# EasyEDA Pro project b6s.eprj, board PCB1
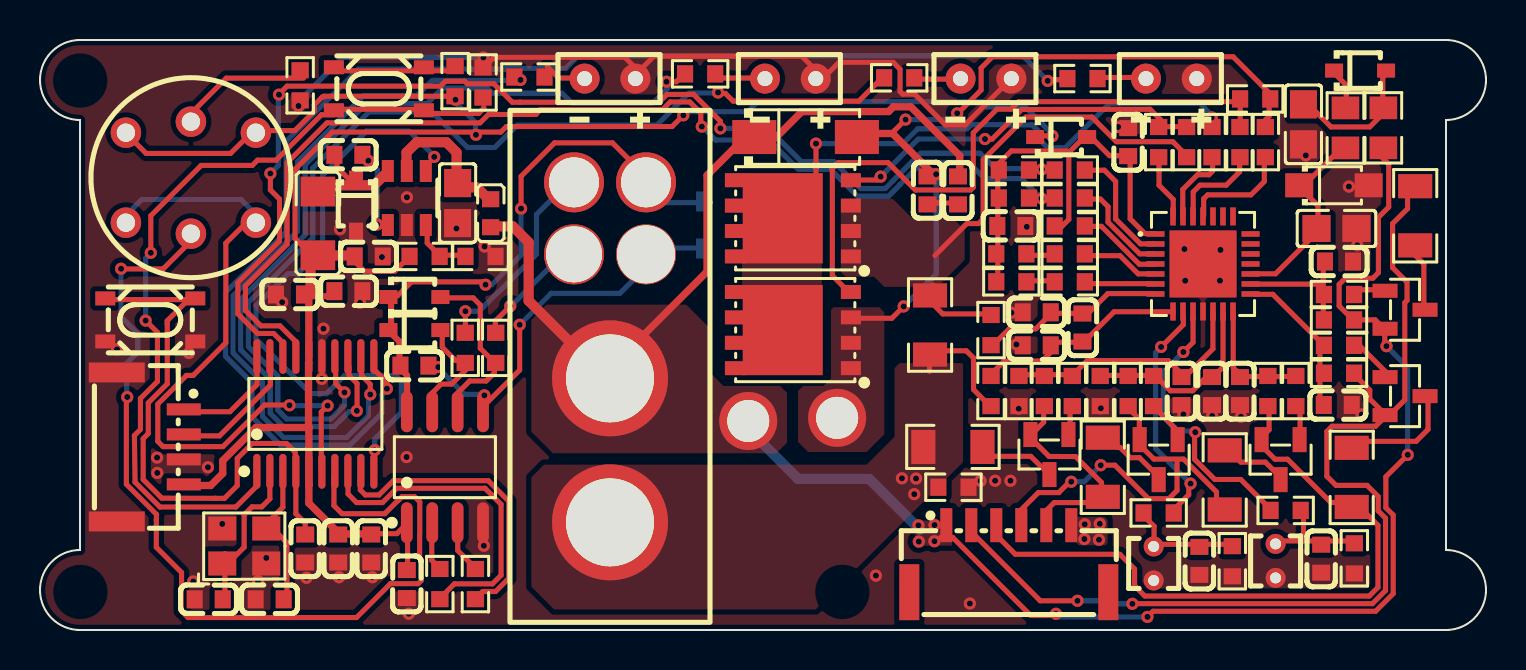
[diagram p1: board, top side]
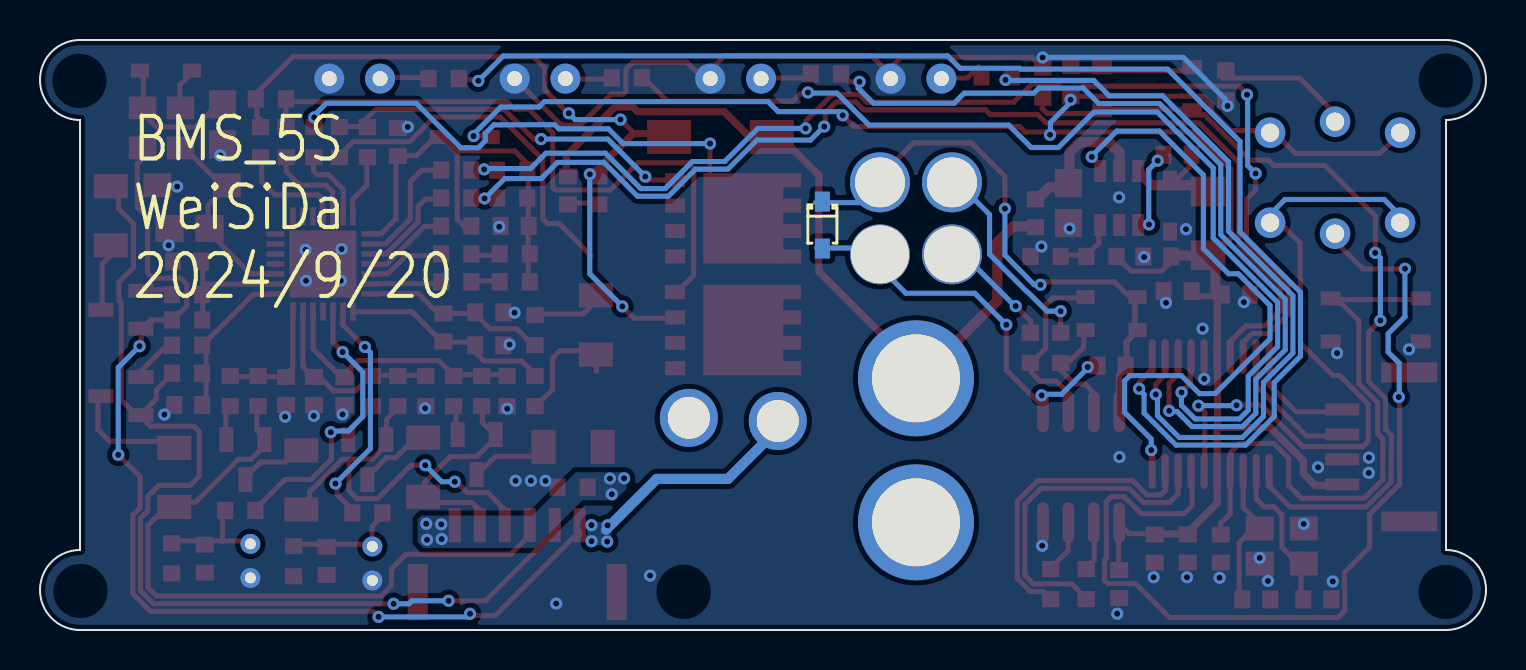
[diagram p2: board, bottom side, seen from below]

Outline 72.3 x 29.5 mm; copper layers: Top Layer, Bottom Layer. Coordinates in mm from the lower left corner of the outline.
Outline path: 2,25.5 arc(0,27.5) 2,29.5 70.3,29.5 arc(72.3,27.5) 70.3,25.5 70.3,4 arc(72.3,2) 70.3,0 2,0 arc(0,2) 2,4 2,25.5
Stack: Top Layer 0.035mm / Dielectric1 1.51mm FR4 er 4.5 / Bottom Layer 0.035mm

## Design rules (mm)
template: 自定义配置
spacing copperThickness1oz (default): track to track 0.127, other pairs 0.152 to 0.3
spacing copperThickness2oz: track to track 0.203, other pairs 0.152 to 0.3
track width copperThickness1oz (default): min 0.127, default 0.254, max 2.54
track width copperThickness2oz: min 0.203, default 0.254, max 2.54
differential pair differentialPair (default): width min 0.127, default 0.254, max 2.54; gap min 0.152, default 0.152
via viaSize (default): diameter min 0.5, default 0.61, max 10; hole min 0.3, default 0.305, max 6.299

## Placement (name value [footprint] x y rotation side)
C1  100nF  [C0603]  48.57 20.2 0 top
C2  10uF  [C0603]  54.41 24.39 90 top
C3  100nF  [C0603]  64.06 3.57 90 top
C4  100nF  [C0603]  57.97 3.45 90 top
C5  100nF  [C0603]  52.12 15.12 90 top
C6  100nF  [C0603]  49.84 15.89 0 top
C7  100nF  [C0603]  49.84 14.23 0 top
C8  100nF  [C0603]  58.6 11.95 90 top
C9  100nF  [C0603]  60 11.95 90 top
C10  100nF  [C0603]  64.89 11.25 180 top
C11  100nF  [C0603]  64.95 18.42 180 top
C13  100nF  [C0603]  57.08 11.95 90 top
C14  2.2uF  [C0805]  63.17 25.28 90 top
C17  100nF  [C0603]  15.42 16.94 180 top
C19  4.7uF  [C0603]  12.5 16.77 0 top
C24  10nF  [C0603]  14.91 4.07 90 top
C25  1uF  [C0603]  16.56 4.07 90 top
C26  100nF  [C0603]  13.26 4.07 90 top
C27  20pF  [C0603]  8.43 1.53 0 top
C28  20pF  [C0603]  11.48 1.53 0 top
C29  4.7uF  [C0805]  20.88 21.35 270 top
C30  100nF  [C0603]  15.42 23.76 0 top
C31  10uF  [C0603]  16.44 18.68 0 top
C32  100nF  [C0603]  18.34 2.3 270 top
C33  2.2uF  [C0805]  64.82 20.08 180 top
C34  100nF  [C0603]  45.9 21.98 90 top
C35  100nF  [C0603]  44.38 21.98 270 top
C36  2.2uF  [C0603]  18.72 13.22 180 top
CN10  WAFER-GH1.25-4PLB  [CONN-SMD_4P-P1.25_XUNPU_WAFER-GH1.25-4PLB]  5.51 9.15 270 top
D1  1N5819WS S4  [SOD-323_L1.6-W1.3-LS2.7-RD]  66 27.97 0 top
D2  SS14  [SMA_L4.2-W2.6-LS5.3-RD]  38.28 24.65 0 top
D3  1N5819WS S4  [SOD-323_L1.6-W1.3-LS2.7-RD]  51.06 24.65 0 top
D4  1N5819WS S4  [SOD-323_L1.6-W1.3-LS2.7-RD]  15.8 21.22 270 top
D6  1N5819WS S4  [SOD-323_L1.6-W1.3-LS2.7-RD]  18.72 16.65 0 top
D7  1N5819WS S4  [SOD-323_L1.6-W1.3-LS2.7-RD]  18.72 15 0 top
D50  SMF24A  [SOD-123FL_L2.7-W1.8-LS3.8-RD]  64.7 22.23 0 top
D51  SD03  [SOD-323_L1.8-W1.3-LS2.5-RD]  33.18 20.25 270 bottom
H9  VOUT  [AMSS_XT60_2+4]  28.5 12.58 180 top
KEY1  -  [LED_BUTTON]  7.55 22.62 180 top
L1  10uH  [L1206]  13.9 20.33 90 top
LED1  XL-257UBC-L  [LED-TH_L5.0-W2.5-P2.54-FD_GREEN_XL-257SYGD-L]  47.3 27.57 180 top
LED2  XL-257UBC-L  [LED-TH_L5.0-W2.5-P2.54-FD_GREEN_XL-257SYGD-L]  37.52 27.57 180 top
LED3  XL-257UBC-L  [LED-TH_L5.0-W2.5-P2.54-FD_GREEN_XL-257SYGD-L]  28.5 27.57 180 top
LED4  XL-257UBC-L  [LED-TH_L5.0-W2.5-P2.54-FD_GREEN_XL-257SYGD-L]  56.57 27.57 180 top
P1  -  [Wire_14AWG]  39.86 10.61 0 top
P2  -  [Wire_14AWG]  35.41 10.45 0 top
Q6  SS8550  [SOT-23-3_L2.9-W1.3-P1.90-LS2.4-BR]  62.03 8.52 90 top
Q7  SS8550  [SOT-23-3_L2.9-W1.3-P1.90-LS2.4-BR]  55.93 8.52 90 top
Q8  SS8550  [SOT-23-3_L2.9-W1.3-P1.90-LS2.4-BR]  50.47 8.77 90 top
Q9  SS8550  [SOT-23-3_L2.9-W1.3-P1.90-LS2.4-BR]  68.25 11.69 180 top
Q10  SS8550  [SOT-23-3_L2.9-W1.3-P1.90-LS2.4-BR]  68.25 16.01 180 top
Q11  NCEP3090GU  [DFN-8_L5.8-W4.9-P1.27-LS6.1-BL-2]  37.64 15 90 top
Q12  NCEP3090GU  [DFN-8_L5.8-W4.9-P1.27-LS6.1-BL-2]  37.64 20.58 90 top
R1  NC  [R0603]  48.95 11.95 90 top
R2  10kΩ  [R0603]  51.49 20.2 180 top
R3  10kΩ  [R0603]  48.69 21.6 180 top
R4  10kΩ  [R0603]  48.69 23 180 top
R5  100Ω  [R0603]  51.49 23 0 top
R6  100Ω  [R0603]  51.49 21.6 0 top
R8  100Ω  [R0603]  51.49 18.81 0 top
R9  100Ω  [R0603]  51.49 17.41 0 top
R10  10kΩ  [R0603]  48.57 18.81 180 top
R11  10kΩ  [R0603]  48.57 17.41 180 top
R12  100Ω  [R0603]  55.93 5.85 0 top
R13  100Ω  [R0603]  62.28 5.98 180 top
R14  MF52A103F3950 (A1)  [RES-TH_L2.5-W2.5-P1.70-D0.3]  55.68 3.33 90 top
R15  NC  [R0603]  65.72 3.58 90 top
R16  MF52A103F3950 (A1)  [RES-TH_L2.5-W2.5-P1.70-D0.3]  61.78 3.45 90 top
R17  NC  [R0603]  59.62 3.44 90 top
R18  5mΩ  [R1206]  44.5 15.25 270 top
R20  100Ω  [R0603]  47.55 11.95 90 top
R21  100Ω  [R0603]  47.55 15 270 top
R22  1kΩ  [R0603]  58.6 24.39 270 top
R23  1kΩ  [R0603]  60 24.39 270 top
R24  1kΩ  [R0603]  55.93 24.39 270 top
R25  10MΩ  [R0603]  57.33 24.39 90 top
R26  1MΩ  [R0603]  60.76 26.55 180 top
R27  1MΩ  [R0603]  61.27 24.39 270 top
R28  NC  [R0603]  53.01 11.95 90 top
R31  1kΩ  [R0603]  64.95 15.5 0 top
R32  510Ω  [R0603]  64.95 16.77 0 top
R33  1kΩ  [R0603]  64.95 12.84 0 top
R34  510Ω  [R0603]  64.95 14.23 0 top
R35  1kΩ  [R0603]  61.39 11.95 270 top
R36  510Ω  [R0603]  62.79 11.95 270 top
R37  1kΩ  [R0603]  54.41 11.95 270 top
R38  510Ω  [R0603]  55.68 11.95 270 top
R39  1kΩ  [R0603]  50.22 11.95 270 top
R40  510Ω  [R0603]  51.61 11.95 270 top
R54  10kΩ  [R0603]  22.15 27.37 270 top
R55  1kΩ  [R0603]  20.75 27.44 90 top
R56  33kΩ  [R0603]  19.23 18.68 180 top
R57  10kΩ  [R0603]  22.02 18.68 180 top
R58  1kΩ  [R0603]  33.01 27.81 180 top
R60  1kΩ  [R0603]  42.96 27.61 180 top
R61  1kΩ  [R0603]  52.12 27.57 180 top
R62  1kΩ  [R0603]  24.47 27.65 180 top
R64  150Ω  [R1206]  68.76 20.71 90 top
R65  150Ω  [R1206]  65.58 7.63 270 top
R66  150Ω  [R1206]  59.23 7.5 270 top
R67  150Ω  [R1206]  53.14 8.14 270 top
R68  150Ω  [R1206]  45.65 9.15 180 top
R69  0Ω  [R0603]  45.67 7.14 0 top
R70  1kΩ  [R0603]  13.01 27.23 270 top
R71  100Ω  [R0603]  19.99 2.3 270 top
R72  100Ω  [R0603]  21.77 2.3 270 top
R73  100Ω  [R0603]  22.79 14.11 90 top
R74  100Ω  [R0603]  21.26 14.11 90 top
R75  51Ω  [R0805]  67.17 25.11 270 top
R76  51Ω  [R0805]  65.27 25.1 90 top
SW13  HX TS3425BA 250gf  [SW-SMD_4P-L4.2-W3.2-P2.15-LS4.6-1]  5.51 15.5 0 top
SW14  HX TS3425BA 250gf  [SW-SMD_4P-L4.2-W3.2-P2.15-LS4.6-1]  16.94 27.06 0 top
U4  SH367303Q/028QY  [QFN-28_L5.0-W5.0-P0.50-TL-EP3.3]  58.15 18.3 0 top
U6  WAFER-GH1.25-6PLB  [CONN-SMD_6P-P1.25_XUNPU_WAFER-GH1.25-6PLB]  48.44 3.57 0 top
U7  GD32E230F8P6TR  [TSSOP-20_L6.5-W4.4-P0.65-LS6.4-BL]  13.77 10.81 0 top
U9  LV2842XLVDDCR  [SOT-23-6_L2.9-W1.6-P0.95-LS2.8-BR]  18.34 21.6 270 top
U10  1uH  [L0603]  22.53 20.84 270 top
U11  π122U31  [SOIC-8_L4.9-W3.9-P1.27-LS6.0-BL]  20.25 8.14 0 top
X1  12MHz  [OSC-SMD_4P-L3.2-W2.5-BL]  10.21 4.2 0 top

## Footprints (pads in the part's own frame, mm; a bottom-side part is the same pattern mirrored in y, then rotated)
AMSS_XT60_2+4
  round 5.8 hole 4.4: 1(0,7.2) 2(0,0)
  round 3 hole 2.9x2.5: 3(-1.8,-6.2)
  round 3 hole 2.8x2.5: 4(1.8,-6.2)
  round 3 hole 2.5: 5(-1.8,-9.8) 6(1.8,-9.8)
C0603
  rect 0.8x0.9 smd: 1(-0.7,0) 2(0.7,0)
C0805
  rect 1.41x1.35 smd: 1(-1,0) 2(1,0)
CONN-SMD_4P-P1.25_XUNPU_WAFER-GH1.25-4PLB
  rect 0.6x1.7 smd: 1(-1.875,1.675) 2(-0.625,1.675) 3(0.625,1.675) 4(1.875,1.675)
  rect 1x2.8 smd: 5(-3.725,-1.675) 6(3.725,-1.675)
CONN-SMD_6P-P1.25_XUNPU_WAFER-GH1.25-6PLB
  rect 0.6x1.7 smd: 1(-3.125,1.675) 2(-1.875,1.675) 3(-0.625,1.675) 4(0.625,1.675) 5(1.875,1.675) 6(3.125,1.675)
  rect 1x2.8 smd: 7(4.975,-1.675) 8(-4.975,-1.675)
DFN-8_L5.8-W4.9-P1.27-LS6.1-BL-2
  rect 0.7x1 smd: 1(-1.905,-2.9) 2(-0.635,-2.9) 3(0.635,-2.9) 4(1.905,-2.9) 5(1.905,2.9) 6(0.635,2.9) 7(-0.635,2.9) 8(-1.905,2.9)
  rect 4.51x4 smd: 8(0,0.508)
L0603
  rect 0.8x0.864 smd: 1(-0.7,0) 2(0.7,0)
L1206
  rect 1.485x1.728 smd: 1(-1.593,0) 2(1.593,0)
LED-TH_L5.0-W2.5-P2.54-FD_GREEN_XL-257SYGD-L
  round 1.5 hole 0.75: 1(-1.27,0) 2(1.27,0)
LED_BUTTON
  round 1.524 hole 0.914: 1(-3.25,2.25) 2(3.25,2.25) 3(-3.25,-2.25) 4(3.25,-2.25) 5(0,2.8) 6(0,-2.8)
OSC-SMD_4P-L3.2-W2.5-BL
  rect 1.4x1.2 smd: 1(-1.1,-0.875) 2(1.1,-0.875) 3(1.1,0.875) 4(-1.1,0.875)
QFN-28_L5.0-W5.0-P0.50-TL-EP3.3
  rect 0.905x0.28 smd: 1(-2.377,1.5) 2(-2.377,1) 3(-2.377,0.5) 4(-2.377,0) 5(-2.377,-0.5) 6(-2.377,-1) 7(-2.377,-1.5) 15(2.377,-1.5) 16(2.377,-1) 17(2.377,-0.5) 18(2.377,0) 19(2.377,0.5) 20(2.377,1) 21(2.377,1.5)
  rect 0.28x0.905 smd: 8(-1.5,-2.377) 9(-1,-2.377) 10(-0.5,-2.377) 11(0,-2.377) 12(0.5,-2.377) 13(1,-2.377) 14(1.5,-2.377) 22(1.5,2.377) 23(1,2.377) 24(0.5,2.377) 25(0,2.377) 26(-0.5,2.377) 27(-1,2.377) 28(-1.5,2.377)
  rect 3.35x3.35 smd: 29(0,0)
R0603
  rect 0.806x0.864 smd: 1(-0.753,0) 2(0.753,0)
R0805
  rect 1.133x1.377 smd: 1(-1,0) 2(1,0)
R1206
  rect 1.208x1.701 smd: 1(-1.479,0) 2(1.479,0)
RES-TH_L2.5-W2.5-P1.70-D0.3
  round 1 hole 0.55: 1(-0.85,0) 2(0.85,0)
SMA_L4.2-W2.6-LS5.3-RD
  rect 2.2x1.7 smd: 1(-2.566,0) 2(2.566,0)
SOD-123FL_L2.7-W1.8-LS3.8-RD
  rect 1.4x1.2 smd: 1(-1.735,0) 2(1.735,0)
SOD-323_L1.6-W1.3-LS2.7-RD
  rect 0.9x0.7 smd: 1(-1.3,0) 2(1.3,0)
SOD-323_L1.8-W1.3-LS2.5-RD
  rect 1x0.75 smd: 1(-1.173,0) 2(1.173,0)
SOIC-8_L4.9-W3.9-P1.27-LS6.0-BL
  oval 0.588x2.045 smd: 1(-1.905,-2.772) 2(-0.635,-2.772) 3(0.635,-2.772) 4(1.905,-2.772) 5(1.905,2.772) 6(0.635,2.772) 7(-0.635,2.772) 8(-1.905,2.772)
SOT-23-3_L2.9-W1.3-P1.90-LS2.4-BR
  rect 1.25x0.7 smd: 1(1,-0.95) 2(1,0.95) 3(-1,0)
SOT-23-6_L2.9-W1.6-P0.95-LS2.8-BR
  rect 1.1x0.6 smd: 1(1.35,-0.95) 2(1.35,0) 3(1.35,0.95) 4(-1.35,0.95) 5(-1.35,0) 6(-1.35,-0.95)
SW-SMD_4P-L4.2-W3.2-P2.15-LS4.6-1
  rect 1x0.7 smd: 1(-2.25,1.075) 2(2.25,1.075) 3(-2.25,-1.075) 4(2.25,-1.075)
TSSOP-20_L6.5-W4.4-P0.65-LS6.4-BL
  oval 0.364x1.742 smd: 1(-2.925,-2.871) 2(-2.275,-2.871) 3(-1.625,-2.871) 4(-0.975,-2.871) 5(-0.325,-2.871) 6(0.325,-2.871) 7(0.975,-2.871) 8(1.625,-2.871) 9(2.275,-2.871) 10(2.925,-2.871) 11(2.925,2.871) 12(2.275,2.871) 13(1.625,2.871) 14(0.975,2.871) 15(0.325,2.871) 16(-0.325,2.871) 17(-0.975,2.871) 18(-1.625,2.871) 19(-2.275,2.871) 20(-2.925,2.871)
Wire_14AWG
  round 2.9 hole 2.1: 1(0,0)

## Nets
As in the schematic.

Pads without a net: U4 18 19 20 21 22 23 24; U6 7 8

## Via types
v1: diameter 0.61, hole 0.305, Top Layer to Bottom Layer, 114 vias

## Routing (per net, layer and track width the routed paths; a pad name or vN(x,y) marks a point on that pad's centre or on a via; arc(x,y) is an arc through that point)
GND: length 41.1
  Top Layer w0.254: 29.94,27.93 30.7,28.69 38.09,28.69 38.95,27.83 ; 29.94,27.93 29.99,27.89 ; 29.94,27.93 29.73,27.72 ; 29.94,27.93 29.24,28.63 22.7,28.63 22.2,28.13 ; 48.41,27.41 46.25,25.25 45.27,25.25 43.73,26.79 43.13,26.79 43,26.92 43,28.04 42.66,28.38 39.95,28.38 39.07,27.51
  Bottom Layer w0.254: 13.04,26.19 13.04,26.54 15.13,28.63 22.1,28.63
  vias: v1(3.85,14.03) v1(5.85,8.62) v1(5.86,7.85) v1(7.45,13.85) v1(7.66,2.43) v1(8.4,8.14) v1(9.11,5.31) v1(10.9,2.45) v1(11.31,3.61) v1(12.11,16.39) v1(12.92,26.2) v1(13.32,2.61) v1(14.09,12.56) v1(14.17,15.07) v1(14.95,2.64) v1(15,20.04) v1(16,16.36) v1(16.62,2.64) v1(17.1,18.65) v1(18.34,21.64) v1(18.33,8.65) v1(18.44,0.81) v1(20.82,20.08) v1(22.17,28.63) v1(22.23,19.17) v1(22.19,4.21) v1(41.8,2.72) v1(46.49,1.32) v1(47.03,7.46) v1(47.75,7.46) v1(48.57,15.86) v1(48.52,7.46) v1(48.82,14.28) v1(48.94,11.06) v1(49.34,20.16) v1(53.04,11.09) v1(53.91,25.15) v1(57.17,10.78) v1(57.22,19.05) v1(57.26,17.46) v1(58.61,10.7) v1(59.02,19) v1(59,17.46) v1(60.05,10.66) v1(63.29,23.73) v1(65.44,22.17) v1(65.87,19.24) v1(66.08,10.77)
SGND: length 17.8
  Top Layer w0.254: 22.09,11.11 23.98,13 v1(23.98,15.26)
  Bottom Layer w0.254: 30.73,18.68 31.15,19.1 33.47,19.1 ; v1(23.98,15.26) 25.56,16.84 29,16.84 30.07,17.9 ; 19.96,13.05 21.22,11.79 22.17,11.79
  vias: v1(19.92,13.15) v1(22.22,11.73)
VBAT+: length 97.7
  Top Layer w0.254: 45.03,4.63 45.63,4.63 49.54,0.72 50.71,0.72 v1(50.8,0.81) ; 65.71,15.59 65.64,15.52 64.96,16.2 64.96,17.28 65.27,17.59 66.65,17.59 66.92,17.86 66.92,20.63 67.44,21.15 67.44,23.3 66.71,24.02 ; 65.66,15.51 66.76,15.51 67.17,15.1 ; v1(67.32,14.19) 67.24,14.28 67.24,15.12 ; v1(55.37,0.66) 55.65,0.94 66.78,0.94 67.66,1.82 67.66,5.75 67.29,6.11 67.29,7.66 v1(68.39,8.76)
  Top Layer w0.363: 45.97,22.82 45.99,22.84 45.99,23.71 43.54,26.16 42.67,26.16 42.43,25.92 38.1,25.92 36.79,24.62 36.28,24.62 ; 29.19,13.76 33.35,17.92 33.35,22.74 35.21,24.6
  Top Layer w0.508: 22.6,20.18 23.64,20.18 24.43,19.39 24.43,16.46 27.47,13.42 27.71,13.42
  Bottom Layer w0.254: v1(50.8,0.81) 50.95,0.66 v1(55.37,0.66) ; v1(67.32,14.19) 68.39,13.13 v1(68.39,8.76)
  Bottom Layer w0.508: 44,5.02 41.46,7.56 37.9,7.56 35.53,9.92 35.5,9.92
  vias: v1(43.92,5.23) v1(43.94,4.42) v1(44.73,5.25) v1(44.72,4.44)
ALARM: length 1.4
  Top Layer w0.254: 50.59,18.79 50.54,18.73 49.24,18.73
BOOT0: length 40.1
  Top Layer w0.254: 10.83,7.66 10.83,7.19 9.79,6.15 5.99,6.15 4.75,7.39 4.72,9.73 5.01,10.02 ; v1(5.28,15.47) 5.87,14.88 5.87,12.43 5.02,11.58 5.02,10.03 ; 14.69,25.79 15.06,26.16 ; 15.06,26.04 18.8,26.04 ; 22.19,26.13 22.19,26.08 21.94,25.83 19.36,25.83 ; v1(5.54,18.86) 5.54,20.71 8.06,23.23 10.62,23.23 10.88,23.49 11.8,23.49 14.07,25.76 14.67,25.76
  Bottom Layer w0.254: v1(5.28,15.47) 5.28,18.6 v1(5.54,18.86)
CHG: length 4.7
  Top Layer w0.254: 59.84,23.47 59.92,23.47 ; 59.98,23.58 59.98,22.91 59.31,22.24 58,22.24 57.66,21.9 57.66,20.64
CHGD: length 5.5
  Top Layer w0.254: 58.18,20.72 58.18,21.56 58.38,21.76 60.55,21.76 61.22,22.43 61.22,23.56 61.31,23.66
DSG: length 3.2
  Top Layer w0.254: 56.66,20.68 56.66,21.53 55.95,22.24 55.95,23.6
DSGD: length 4
  Top Layer w0.254: 58.67,23.42 58.63,23.47 ; 58.63,23.47 58.53,23.57 ; 58.63,23.47 58.63,22.94 58.45,22.76 57.87,22.76 57.14,22.03 57.14,20.64
LED0: length 45.9
  Top Layer w0.254: 7.5,19.39 6.16,18.05 4.12,18.05 ; 5.81,5.51 5.81,4.14 7.08,2.87 7.08,2.12 7.06,2.1 7.06,0.97 7.4,0.62 15.83,0.62 17.52,2.32 18.91,2.32 19.07,2.48 19.07,3.51 18.98,3.6 18.98,4.75 ; 5.81,5.51 5.81,5.52 ; 5.81,5.51 5.83,5.78 4.32,7.29 4.32,11.61 v1(4.36,11.65) ; 18.99,4.77 18.99,6.41 18.73,6.67 18.1,6.67 17.93,6.49 17.92,6.49 ; 17.9,6.48 17.24,5.81 15.12,5.81 ; 14.7,7.66 14.7,6.22 15.09,5.82
  Bottom Layer w0.254: 4.34,11.7 4.34,13.34 4.89,13.9 4.89,14.82 4.05,15.66 v1(4.05,18.06)
LED1: length 52.1
  Top Layer w0.254: 33.85,26.83 34.27,26.83 34.65,26.44 40.94,26.44 42.13,27.64 ; v1(15.22,11.88) 14.79,12.32 14.79,13.02
  Bottom Layer w0.254: 19.57,25.9 16.44,25.9 13.64,23.1 13.64,19.6 10.42,16.38 10.42,14.16 11.89,12.69 11.89,10.99 12.33,10.55 14.54,10.55 15.23,11.24 15.23,11.83 ; 19.57,25.87 19.63,25.87 21.38,24.12 22.74,24.12 23.86,25.24 30.85,25.24 32.45,26.84 33.95,26.84 33.99,26.8
  vias: v1(33.9,26.88)
LED2: length 42.9
  Top Layer w0.254: v1(15.84,10.96) 15.85,10.97 15.85,12.33 15.44,12.73 15.44,13.17 ; 31.92,27.52 31.81,27.41 v1(31.33,27.41)
  Bottom Layer w0.254: 22.56,26.89 22.35,27.1 20.14,27.1 19.36,26.32 16.37,26.32 ; 15.83,10.93 15.46,10.93 14.7,10.17 12.17,10.17 11.51,10.84 11.51,12.53 10.04,14 10.04,16.54 13.26,19.76 13.26,23.26 16.33,26.33 ; 22.6,26.84 26.09,26.84 26.6,26.34 30.63,26.34 31.39,27.1 31.39,27.35 v1(31.33,27.41)
LED3: length 36.1
  Top Layer w0.254: v1(16.51,11.78) 16.51,12.29 16.08,12.72 16.08,12.98
  Bottom Layer w0.254: 23.91,27.47 23.91,27.48 19.61,27.48 18.84,26.71 16.18,26.71 12.88,23.42 12.88,19.95 9.66,16.72 9.66,13.85 11.13,12.38 11.13,10.68 12.18,9.63 15.33,9.63 16.43,10.72 16.43,11.74 16.47,11.79
  vias: v1(24.03,27.5)
LED4: length 67.1
  Top Layer w0.254: v1(50.38,27.46) 50.44,27.51 51.33,27.51 ; v1(17.34,12.06) 17.34,12.39 16.71,13.02
  Bottom Layer w0.254: v1(50.38,27.46) 49.14,28.7 26.91,28.7 26.29,28.09 23.33,28.09 23.28,28.04 15.92,28.04 12.3,24.43 12.3,19.91 9.28,16.88 9.28,13.69 10.59,12.37 10.59,10.68 12.02,9.25 15.49,9.25 17.1,10.85 17.1,11.78 17.34,12.02
MCU+3.3V: length 96.1
  Top Layer w0.254: 10.51,24.81 9.53,23.83 5.31,23.83 4.38,24.75 ; 18.38,3.03 18.38,4.54 18.33,4.59 ; 14.18,26.67 14.19,26.69 20.7,26.69 ; 49.82,24.71 50.58,24.71 ; 18.31,5.29 17.84,4.82 16.44,4.82 ; 11.27,24.97 12.74,24.97 13.72,25.95 13.72,26.26 14.11,26.64 14.19,26.64 ; 18.47,18.73 18.47,18.67 17.74,17.94 16.22,17.94 15.83,18.32 ; 13.37,18.96 12.75,19.58 12.75,23.04 14.61,24.9 23.04,24.9 23.32,25.17 31.6,25.17 v1(32.17,25.73)
  Top Layer w0.305: 14.6,16.76 14.54,16.69 13.41,16.69
  Top Layer w0.363: 13.44,10.12 13.44,7.24 ; 13.44,10.12 10.79,10.12 9.14,8.47 9.14,7.83 8.53,7.22 8.02,7.22 ; 13.44,10.12 13.43,10.14 13.43,13.36 13.44,13.37 ; 13.44,10.12 13.45,10.12 13.46,10.12 ; 13.44,7.24 13.45,7.23 ; 13.44,7.24 13.44,6.34 14.79,4.99 14.79,4.95 ; 13.44,13.66 13.44,16.66 13.41,16.69 13.38,16.72 ; 16.38,4.82 16.37,4.8 14.98,4.8
  Top Layer w0.508: 13.53,16.94 13.53,18.29 ; 13.91,18.73 15.48,18.73 15.5,18.74
  Bottom Layer w0.254: v1(32.17,25.73) 32.35,25.92 35.39,25.92 35.9,26.42 47.08,26.42 47.35,26.15 49.27,26.15 50.7,24.72 ; 21.78,24.76 21.78,25.38 20.64,26.51
  vias: v1(20.77,26.51) v1(21.8,24.76) v1(50.62,24.7)
MCUPW_EN: length 29.7
  Bottom Layer w0.254: 19.69,23.72 18.46,24.95 16.33,24.95 14.13,22.75 14.13,19.07 12.87,17.81 ; v1(16.74,8.99) 16.74,9.55 18.07,10.88 18.07,12.46 17.81,12.72 15.23,12.72 14.32,11.82 13.84,11.82 ; 13.82,11.82 13.53,11.82 10.8,14.56 10.8,16.22 12.39,17.81 12.87,17.81
  vias: v1(19.71,23.66)
NRST: length 28.6
  Top Layer w0.254: 6.36,15.3 6.36,15.45 ; 6.36,15.3 6.37,15.47 7.42,16.52 ; 6.36,15.3 6.36,12.31 5.41,11.36 5.41,9.82 5.16,9.57 5.16,7.52 6.09,6.59 8.77,6.58 ; 8.77,6.58 9.22,6.58 9.86,7.22 9.86,8.58 10.61,9.33 12.32,9.33 12.76,8.89 12.79,7.91 ; 8.77,6.58 8.73,6.58 ; 7.42,16.52 7.52,16.63 ; 7.42,16.52 3.55,16.52 ; 12.79,7.91 12.79,5.81 13.26,5.34 C26.2 ; 12.79,7.91 U7.4
OSC_IN: length 8.3
  Top Layer w0.254: U7.2 11.49,6.56 11.09,6.16 10.6,6.16 10.21,5.76 10.21,4.14 9.53,3.46 9.25,3.74 ; 9.25,3.74 9.25,1.7 ; 9.25,3.74 9.11,3.61 ; 9.25,3.74 9.25,3.82
OSC_OUT: length 6.7
  Top Layer w0.254: U7.3 12.14,6.14 11.31,5.31 ; 11.62,5.08 12.35,4.36 12.35,1.88 12.21,1.75
PA0: length 33.1
  Top Layer w0.254: v1(14.38,11.22) 14.06,10.9 14.06,8.06 ; 12.47,11.25 11.23,11.25 9.15,9.17 6.15,9.17 5.88,9.44 ; 5.89,9.46 5.89,11.3 7.32,12.73 7.66,12.73 9.29,14.36 9.29,17.69 ; 9.29,17.71 9.29,19.34 10.83,20.88
  Bottom Layer w0.254: v1(14.38,11.22) 12.49,11.22 v1(12.47,11.24) ; 4.62,21.05 5.09,21.53 10.05,21.53 10.76,20.81
POGND: length 5.8
  Top Layer w0.254: 47.42,11.28 46.68,12.02 46.68,13.6 46.32,13.96 44.83,13.96 44.48,13.61 44.48,12.93
  vias: v1(43.1,7.59) v1(43.71,6.79) v1(43.8,7.57) v1(52.24,5.28) v1(52.22,4.55) v1(52.99,5.31) v1(52.95,4.51)
RESET: length 1.1
  Top Layer w0.254: 50.59,17.45 50.58,17.46 49.45,17.46
S+3.3V: length 27.9
  Top Layer w0.254: 30.32,22.66 28.62,24.36 25.73,24.36 24.05,22.68 v1(24.05,21.07) ; v1(22.28,17.26) 22.13,17.41 18.58,17.41 17.87,16.7
  Top Layer w0.305: 17.97,13.11 18.35,12.73 18.35,10.89 ; 17.59,16.69 17.55,16.65 17.55,14.97 ; 17.55,14.84 17.97,14.42 17.97,13.19
  Bottom Layer w0.254: 30.62,22.12 31.37,21.37 33.52,21.37 ; v1(22.28,17.26) 22.59,17.26 24.05,18.75 v1(24.05,21.07)
SCL: length 55.8
  Top Layer w0.254: 24.8,25.8 25.01,26.01 31.11,26.01 31.5,26.4 32.49,26.4 33.04,25.85 33.04,25.2 ; 12.36,19.28 12.36,23.37 14.35,25.36 22,25.36 22.42,25.78 24.8,25.78 ; 50.53,21.59 50.45,21.51 49.61,21.51 ; 12.79,13.67 12.79,14.41 12,15.21 11.05,15.21 10.27,15.98 10.27,17.2 12.35,19.28
  Bottom Layer w0.254: v1(33.09,25.17) 33.1,25.17 33.78,24.5 36.45,24.5 36.88,24.07 ; 36.88,24.07 37.91,23.04 39.53,23.04 40.88,21.69 42.42,21.69 43,22.27 43,22.27 43.3,22.57 ; 43.32,22.57 43.3,22.57 ; 43.3,22.57 44.11,23.38 46.03,23.38 ; 46.03,23.38 46.43,23.38 47.24,22.57 49.07,22.57 50.05,21.58
  vias: v1(50.07,21.58)
SDA: length 59
  Top Layer w0.254: 12.16,13.69 12.16,14.35 11.68,14.83 10.87,14.83 9.89,15.81 9.89,17.36 11.98,19.45 11.98,21.55 11.52,22 v1(11.52,22.83) ; 50.64,22.96 50.6,23 49.5,23 ; 24,26.39 23.61,26.39 22.86,27.14 22.69,27.31 21.36,27.31 21.24,27.44 20.27,27.44 20.03,27.19 12.35,27.19 12.03,26.87 ; 24,26.39 24,26.38 ; 24,26.39 30.96,26.39 31.35,26.78 32.68,26.78 34.02,25.44 v1(34.02,25.08)
  Bottom Layer w0.254: v1(34.02,25.08) 36.41,25.08 38.06,23.42 39.68,23.42 41.04,22.07 42.26,22.07 42.27,22.08 42.28,22.08 42.62,22.43 42.62,22.43 44.03,23.84 47,23.84 47.77,23.07 50.13,23.07 ; v1(11.52,22.83) 11.92,23.22 11.92,26.73 v1(11.95,26.77)
  vias: v1(50.09,23.03)
SH_+3.3V: length 21.7
  Top Layer w0.254: 50.78,20.18 51.1,20.18 51.44,20.53 51.44,23.84 ; 54.36,23.72 53.47,23.72 52.7,24.49 ; 55.77,19.82 55.24,19.82 54.51,20.56 54.51,23.58 ; 47.87,23.26 48.57,23.95 51.32,23.95 51.44,23.84 ; 51.44,23.84 51.44,23.88 52.07,24.51 52.7,24.51 ; 48.01,22.87 47.89,22.75 47.89,17.35
SWCLK: length 4.6
  Top Layer w0.254: 10.85,13.26 10.85,12.27 9.49,10.91 7.79,10.91
SWDIO: length 5.5
  Top Layer w0.254: 7.93,9.71 8.98,9.71 11.52,12.25 11.52,13.07 11.5,13.09
USART_RX: length 14.7
  Top Layer w0.254: 21.75,1.54 22.14,1.92 22.78,1.92 23.44,2.58 23.44,6.44 22.41,7.47 17.67,7.47 16.95,6.75 16.27,6.75 16.01,7.01 16.01,7.46 15.98,7.49
USART_RX2: length 9.2
  Top Layer w0.254: 21.27,14.97 v1(21.27,15.94)
  Bottom Layer w0.254: 25.98,21.78 25.83,21.78 24.82,20.77 24.82,18.79 22.95,16.92 ; v1(21.27,15.94) 21.96,15.94 22.92,16.9
USART_TX: length 16.2
  Top Layer w0.254: 19.94,1.53 20.72,2.31 22.62,2.31 23.05,2.74 23.05,6.28 22.25,7.09 17.84,7.09 17.12,6.37 15.83,6.37 15.4,6.8 15.4,7.37
USART_TX2: length 5.4
  Top Layer w0.254: 22.76,15.05 22.76,15.45 v1(23.51,16.2)
  Bottom Layer w0.254: 26.53,18.33 25.69,18.33 23.5,16.15
$1N1320: length 12.3
  Top Layer w0.254: 57.11,12.77 56.41,13.47 52.36,13.47 51.83,12.95 ; 57.19,12.55 57.19,12.6 58.65,14.06 58.65,15.92 ; 51.45,12.77 48.86,12.77
$1N1728: length 6.2
  Top Layer w0.254: 55.79,19.31 55.02,19.31 53.78,20.55 53.78,22.43 53.22,22.99 52.18,22.99
$1N1734: length 4.9
  Top Layer w0.254: 55.76,18.8 55.76,18.81 54.99,18.81 53.4,20.39 53.4,21.17 53.02,21.55 52.42,21.55
$1N1741: length 4.2
  Top Layer w0.254: 52.31,20.18 53.07,20.18 54.97,18.29 55.74,18.29
$1N1748: length 3.7
  Top Layer w0.254: 52.36,18.72 54,18.72 54.91,17.81 55.73,17.81
$1N1755: length 3.6
  Top Layer w0.254: 55.78,17.32 52.39,17.32 52.21,17.5
$1N2187: length 5.5
  Top Layer w0.254: 55.7,4.3 55.7,5.19 55.11,5.78 ; 59.46,4.23 59.41,4.28 55.7,4.28
$1N2189: length 5.5
  Top Layer w0.254: 65.75,4.45 63.18,4.45 ; 63.18,4.45 63.18,5.65 63,5.82 ; 63.18,4.45 61.94,4.45 61.8,4.31
$1N2279: length 13.8
  Top Layer w0.254: 58.17,8.1 58.74,7.53 60.04,7.53 61.59,5.97 ; v1(57.17,13.9) 57.65,14.39 57.65,15.68 ; 57.79,9.86 57.73,9.79 57.73,8.53 58.15,8.12
  Bottom Layer w0.254: v1(57.17,13.9) 56.16,12.89 56.16,10.66 56.87,9.95 57.7,9.95 v1(57.76,9.89)
$1N2284: length 11.4
  Top Layer w0.254: 56.62,5.95 57.44,6.77 57.44,7.23 v1(57.53,7.32) ; v1(56.06,14.15) 57.17,15.26 57.17,15.64
  Bottom Layer w0.254: v1(57.53,7.32) 55.78,9.07 55.78,13.88 v1(56.06,14.15)
$1N2390: length 6.2
  Top Layer w0.254: 60.02,12.67 60.1,12.67 ; 60.1,12.67 62.74,12.67 62.76,12.69 ; 60.1,12.67 60.14,12.63 ; 59.66,15.92 59.66,13.11 60.06,12.71
$1N2395: length 9.5
  Top Layer w0.254: 52.82,12.73 55.48,12.73 55.54,12.79 ; 55.68,12.54 55.94,12.54 56.52,11.96 57.63,11.96 58.21,12.54 58.52,12.54 58.61,12.62 ; 58.74,12.73 59.15,13.15 59.15,15.91
$1N2545: length 10.2
  Top Layer w0.254: 56.66,15.91 53.71,15.91 52.34,14.55 ; 50.71,14.06 50.1,13.45 48.21,13.45 47.56,12.8 ; 50.56,14.31 50.63,14.39 52.16,14.39
$1N2550: length 8.8
  Top Layer w0.254: 52.16,15.89 52.46,15.89 53.39,16.82 55.75,16.82 ; 52.08,15.83 50.52,15.83 50.5,15.82 ; 47.6,14.2 48.46,15.06 49.79,15.06 50.3,15.57
$1N2582: length 22.1
  Top Layer w0.254: 57.37,23.68 56.64,24.42 53.82,24.42 52.78,25.46 52.78,25.47 52.6,25.65 49.29,25.65 47.16,23.51 47.16,20.55 46.93,20.32 46.34,20.32 44.75,18.72 ; 44.64,17.26 44.56,17.18 44.56,16.38 45.14,15.8 47.45,15.8
$1N2939: length 32.7
  Top Layer w0.254: 43.78,21.99 42.4,23.37 39.91,23.37 39.62,23.07 39.62,17.72 40.35,16.99 40.35,16.87 ; 43.81,22 46.53,22 46.66,22.13 46.66,24.86 47.84,26.04 48.56,26.04 48.94,26.42 59.93,26.42 60.01,26.34 ; 60.01,26.34 60.01,26.61 ; 60.01,26.34 60.01,25.37 59.8,25.16 ; 60.01,26.34 60.14,26.34
$1N2941: length 18.8
  Top Layer w0.254: 57.52,25.13 57.48,25.17 55.93,25.17 ; v1(42.03,22.67) 41.87,22.5 40.64,22.5 ; v1(47.25,24.55) 47.61,24.55 49.09,26.03 55.5,26.03 56.03,25.51 56.03,25.38
  Bottom Layer w0.254: v1(47.25,24.55) 43.91,24.55 v1(42.03,22.67)
$1N3087: length 7.4
  Top Layer w0.254: 64,14.43 61.64,16.78 60.73,16.78 ; 64.11,11.27 64,11.38 64,14.42
$1N3093: length 6.5
  Top Layer w0.254: 64.02,17.2 63.93,17.29 60.51,17.29 ; 64.16,18.44 64.16,15.5 64.19,15.48
$1N3779: length 6.3
  Top Layer w0.254: 63.56,26.14 64.55,25.15 66.49,25.15 67.16,25.83 67.16,25.97 ; 67.14,26.11 67.14,27.63 67.4,27.9
$1N3964: length 1.6
  Top Layer w0.254: 67.2,17.01 65.62,17.01
$1N4014: length 2
  Top Layer w0.254: 67.26,12.83 67.26,12.93 65.95,14.24
$1N4065: length 1.7
  Top Layer w0.254: 62.94,11.21 63,11.14 63,9.58
$1N4115: length 1.9
  Top Layer w0.254: 56.74,9.78 56.74,10.11 55.64,11.21
$1N4165: length 1.4
  Top Layer w0.254: 51.5,9.84 51.5,10.92 51.72,11.14
$1N4198: length 50.5
  Top Layer w0.254: 65.77,12.72 66.49,12 66.49,11.55 67.26,10.78 ; 46.62,4.86 50.01,1.46 v1(51.87,1.46) ; 68.38,22.18 68.38,21.07 67.63,20.32 67.63,18.11 68.35,17.39 68.35,16.48 68.24,16.37 68.24,11.51 67.59,10.86 ; v1(54.62,1.31) 54.63,1.32 66.62,1.32 67.28,1.97 67.28,5.59 66.91,5.96 66.91,6.67 66.35,7.23 64.8,7.23 64.34,7.69 64.34,9.93 64.6,10.19 66.78,10.19 67.27,10.68
  Bottom Layer w0.254: v1(51.87,1.46) 53.7,1.46 53.86,1.31 v1(54.62,1.31)
$1N4220: length 32.1
  Top Layer w0.254: 65.16,6.37 64.55,6.37 62.38,8.54 61.75,8.54 61.22,9.06 ; 66.19,5.94 66.9,5.23 66.9,2.13 66.46,1.7 55.24,1.7 54.73,2.21 54.73,3.05 53.99,3.79 48.77,3.79 47.82,4.73 ; 61,9.56 61.46,10.01 61.46,11.27
$1N4226: length 18.8
  Top Layer w0.254: v1(53.04,8.24) 53.75,8.24 55.42,6.57 56.44,6.57 56.85,6.98 56.85,8.46 ; 49.04,5.23 49.04,5.99 49.92,6.87 50.94,6.87 51.48,7.41 v1(51.56,7.41) ; 54.99,9.25 55.69,8.55 57.18,8.55 58.82,6.9 58.82,6.42 ; 54.4,11.11 54.97,10.54 54.97,9.66
  Bottom Layer w0.254: v1(53.04,8.24) 52.21,7.41 v1(51.56,7.41)
$1N4232: length 9.4
  Top Layer w0.254: 53.08,6.94 53.08,7.37 51.78,8.67 50.94,8.67 50.94,8.68 50.45,8.68 49.67,9.46 ; 52.83,6.56 52.64,6.37 50.71,6.37 50.38,6.04 50.38,5.59 ; 50.18,11.11 50.18,10.39 49.59,9.8
$1N9134: length 5.6
  Top Layer w0.254: 19.05,27.96 20.39,27.96 ; 18.99,27.94 18.97,27.96 14.72,27.96
$1N9618: length 7
  Top Layer w0.508: 20.83,22.45 20.83,23.88 20.32,24.39 18.84,24.39 18.33,23.88 18.33,22.9 ; 22.35,21.62 21.84,22.13 20.87,22.13
$1N9847: length 5.6
  Top Layer w0.254: 15.72,22.53 15.46,22.53 14.85,23.13 14.85,23.92
  Top Layer w0.508: 13.98,22.21 14,22.24 16.71,22.24 17.35,22.88
$1N9920: length 3.3
  Bottom Layer w0.254: 16.86,20.33 16.86,23.02 v1(16.42,23.47)
  vias: v1(16.85,20.28)
$1N9975: length 3
  Top Layer w0.254: 19.96,18.74 21.18,18.74 21.22,18.78 ; 19.92,18.78 19.36,19.35 19.36,20.24
$1N15428: length 3.2
  Top Layer w0.254: 69.19,16.17 69.19,18.3 68.44,19.06
$1N15454: length 5.8
  Top Layer w0.254: 65.43,9.43 68.8,9.43 69.4,10.03 69.4,11.62
$1N15480: length 3.1
  Top Layer w0.254: 62.05,7.61 61.27,8.39 60.04,8.39 59.49,8.94
$1N15506: length 2.7
  Top Layer w0.254: 55.97,7.62 54.97,8.61 54.52,8.61 54,9.13 53.86,9.13
$1N15532: length 3.4
  Top Layer w0.254: 47.33,8.68 49.54,8.68 50.39,7.83
$1N16008: length 1.1
  Top Layer w0.254: 44.84,21.37 44.86,21.35 45.88,21.35 45.89,21.36
$1N16122: length 8.2
  Top Layer w0.254: 64.83,23.96 64.83,23.86 63.2,22.23 ; 63.9,20.16 63.9,21.22 63.1,22.02 ; 63.46,19.5 61.77,17.81 60.62,17.81
$1N16427: length 24.3
  Top Layer w0.254: 38.33,22.31 38.8,22.78 v1(38.8,24.32)
  Bottom Layer w0.254: 57.99,26.34 53.49,26.34 51.26,24.11 51,24.11 51,24.11 50.38,24.11 50.04,24.46 50.04,24.83 49.61,25.26 46.57,25.27 46.36,25.06 43.88,25.06 43.14,24.32 v1(38.8,24.32) ; 57.99,26.33 58.6,25.72
  vias: v1(58.59,25.63)
$1N16448: length 38.3
  Top Layer w0.254: 61.47,26.5 61.47,26.85 59.66,28.66 47.62,28.66 47.06,28.1 47.06,27 45.9,25.84 v1(45.86,25.84) ; 40.66,15.59 42.59,15.59 v1(43.18,16.18) ; v1(43.28,25.52) 42.72,24.96 42.72,24.84 ; 61.46,26.46 61.46,25.69 61.16,25.4
  Top Layer w0.363: 40.77,24.83 42.63,24.83 44.66,22.79 v1(44.81,22.79)
  Bottom Layer w0.254: v1(44.81,22.79) 44.81,17.8 v1(43.18,16.18) ; v1(43.28,25.52) 45.54,25.52 v1(45.86,25.84)
$1N16731: length 6.7
  Top Layer w0.254: 13.17,27.59 9.32,27.59 7.65,25.93 7.65,25.48
$1N26616: length 1.7
  Top Layer w0.254: 19.97,3.11 19.59,3.49 19.59,4.64
$1N26644: length 2.2
  Top Layer w0.254: 20.9,4.94 20.89,4.93 20.89,3.97 21.78,3.08
$1N26707: length 5
  Top Layer w0.254: 20.11,14.78 20.11,14.14 20.77,13.48 21.18,13.48 ; 21.29,13.2 21.29,13 20.58,12.3 20.06,12.3 19.59,11.83 19.59,11.17
$1N26714: length 8.6
  Top Layer w0.254: 22.76,13.34 22.01,14.09 22.01,16.25 21.66,16.61 20.19,16.61 20.11,16.53 ; 22.72,13.25 22.72,12.86 22.31,12.45 21.48,12.45 20.88,11.85 20.88,11.23
$1N36650: length 2.5
  Top Layer w0.254: 36.37,27.6 33.91,27.6 33.86,27.65
$1N36652: length 2.3
  Top Layer w0.254: 43.72,27.54 45.99,27.54 46.01,27.57
$1N36654: length 2
  Top Layer w0.254: 55.04,27.63 53.06,27.63
$1N36656: length 2.2
  Top Layer w0.254: 27.3,27.6 25.94,27.6 25.36,28.18
$1N45494: length 1.9
  Top Layer w0.254: 65.31,26.27 65.31,27.24 64.66,27.9

## Copper pours and planes (outline as drawn; the poured copper is in the pictures)
GND on Top Layer: -1.82,30.87 73.93,30.87 73.93,-0.36 -1.82,-0.36
GND on Bottom Layer: -1.13,29.96 73.65,29.96 73.65,-1.25 -1.13,-1.25
VBAT+ on Top Layer: 24.56,16.27 37.35,16.27 37.35,8.84 24.56,8.84
VBAT+ on Top Layer: 43.76,5.48 45.59,5.48 45.59,4.22 43.76,4.22
VBAT+ on Bottom Layer: 43.74,5.41 44.93,5.41 44.93,4.24 43.74,4.24
POGND on Top Layer: 51.29,5.68 53.38,5.68 53.38,4.23 51.29,4.23
POGND on Top Layer: 42.72,9.66 42.72,13.09 42.98,13.34 46.15,13.34 46.15,8.39 38.79,1.03 25.71,1.03 24.56,2.17 24.56,7.63 25.2,8.27 41.33,8.27
POGND on Bottom Layer: 42.98,7.89 53.42,7.89 53.42,4.1 42.98,4.1
$1N2582 on Top Layer: 40.04,21.56 46.23,21.56 46.23,17.16 40.04,17.16
$1N16427 on Top Layer: 35.11,18.81 39.09,18.81 39.09,15.38 35.11,15.38
$1N16448 on Top Layer: 37.9,16.14 42.22,16.14 42.22,8.9 37.9,8.9

## Text on the board
Bottom Silkscreen Layer: BMS_5S / WeiSiDa / 2024/9/20
